# EAGLE schematic spin (EAGLE 6.3)
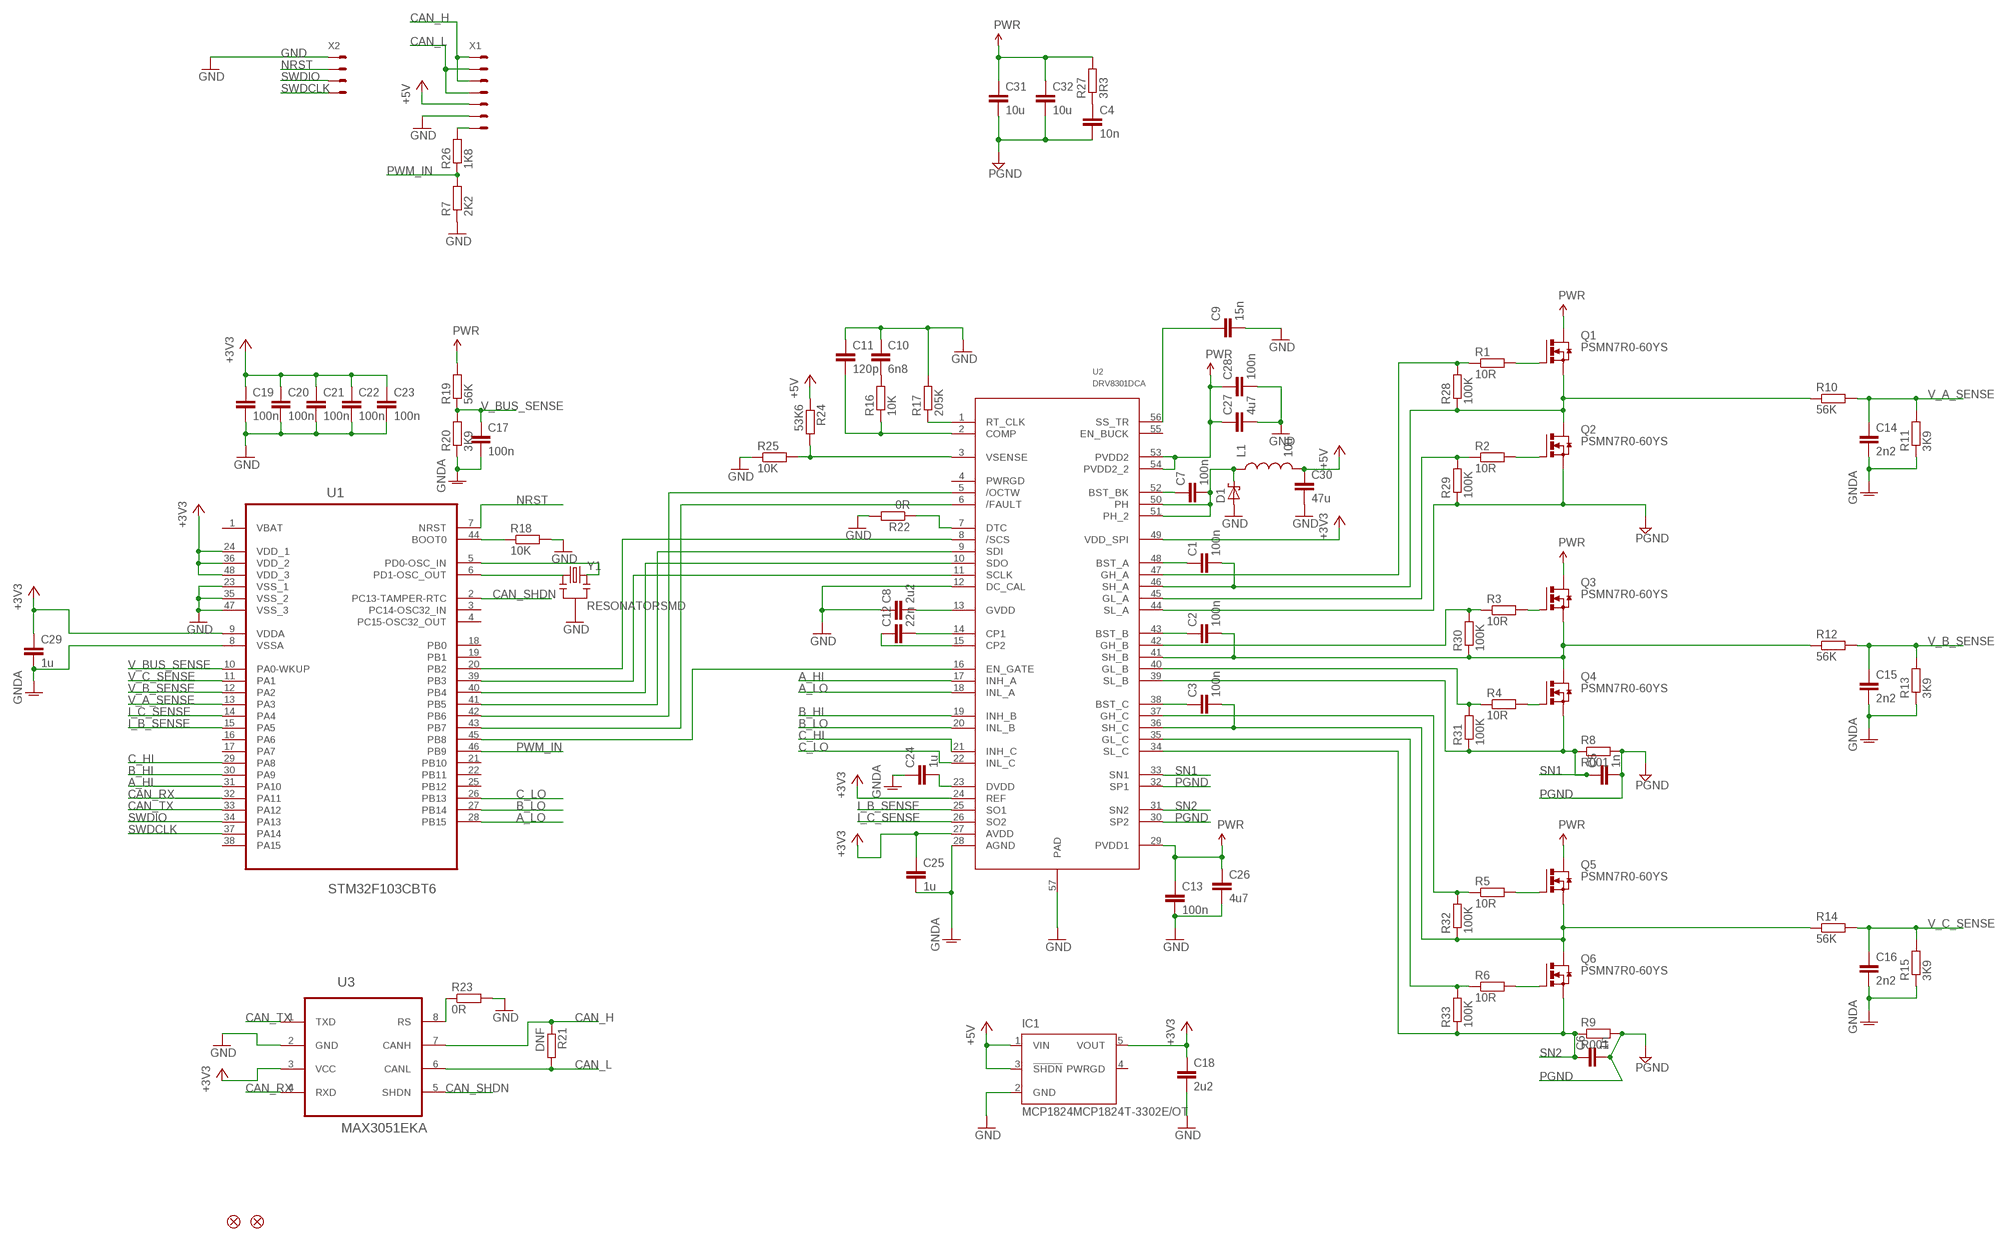
[diagram p0: schematic, sheet 1]

## Parts
C1  100n  C-EUC0603  [C0603]
C2  100n  C-EUC0603  [C0603]
C3  100n  C-EUC0603  [C0603]
C4  10n  C-EUC0603  [C0603]
C5  1n  C-EUC0603  [C0603]
C6  1n  C-EUC0603  [C0603]
C7  100n  C-EUC0603  [C0603]
C8  2u2  C-EUC0603  [C0603]
C9  15n  C-EUC0603  [C0603]
C10  6n8  C-EUC0603  [C0603]
C11  120p  C-EUC0603  [C0603]
C12  22n  C-EUC0603  [C0603]
C13  100n  C-EUC0603  [C0603]
C14  2n2  C-EUC0603  [C0603]
C15  2n2  C-EUC0603  [C0603]
C16  2n2  C-EUC0603  [C0603]
C17  100n  C-EUC0603  [C0603]
C18  2u2  C-EUC0603  [C0603]
C19  100n  C-EUC0603  [C0603]
C20  100n  C-EUC0603  [C0603]
C21  100n  C-EUC0603  [C0603]
C22  100n  C-EUC0603  [C0603]
C23  100n  C-EUC0603  [C0603]
C24  1u  C-EUC0603  [C0603]
C25  1u  C-EUC0603  [C0603]
C26  4u7  C-EUC0805  [C0805]
C27  4u7  C-EUC0805  [C0805]
C28  100n  C-EUC0603  [C0603]
C29  1u  C-EUC0603  [C0603]
C30  47u  CAP1210  [1210]
C31  10u  CAP1210  [1210]
C32  10u  CAP1210  [1210]
D1  STPS1H100AF  [SMA]
IC1  MCP1824MCP1824T-3302E/OT  [SOT23-5L]
JP1  FIDUCIALUFIDUCIAL  [MICRO-FIDUCIAL]
JP2  FIDUCIALUFIDUCIAL  [MICRO-FIDUCIAL]
L1  10u  INDUCTORNR6028  [NR6028]
Q1  PSMN7R0-60YS  [POWER-SO8-UNIVERSAL]
Q2  PSMN7R0-60YS  [POWER-SO8-UNIVERSAL]
Q3  PSMN7R0-60YS  [POWER-SO8-UNIVERSAL]
Q4  PSMN7R0-60YS  [POWER-SO8-UNIVERSAL]
Q5  PSMN7R0-60YS  [POWER-SO8-UNIVERSAL]
Q6  PSMN7R0-60YS  [POWER-SO8-UNIVERSAL]
R1  10R  R-EU_R0603  [R0603]
R2  10R  R-EU_R0603  [R0603]
R3  10R  R-EU_R0603  [R0603]
R4  10R  R-EU_R0603  [R0603]
R5  10R  R-EU_R0603  [R0603]
R6  10R  R-EU_R0603  [R0603]
R7  2K2  R-EU_R0603  [R0603]
R8  R001  R-EU_R1210  [R1210]
R9  R001  R-EU_R1210  [R1210]
R10  56K  R-EU_R0603  [R0603]
R11  3K9  R-EU_R0603  [R0603]
R12  56K  R-EU_R0603  [R0603]
R13  3K9  R-EU_R0603  [R0603]
R14  56K  R-EU_R0603  [R0603]
R15  3K9  R-EU_R0603  [R0603]
R16  10K  R-EU_R0603  [R0603]
R17  205K  R-EU_R0603  [R0603]
R18  10K  R-EU_R0603  [R0603]
R19  56K  R-EU_R0603  [R0603]
R20  3K9  R-EU_R0603  [R0603]
R21  DNF  R-EU_R0603  [R0603]
R22  0R  R-EU_R0603  [R0603]
R23  0R  R-EU_R0603  [R0603]
R24  53K6  R-EU_R0603  [R0603]
R25  10K  R-EU_R0603  [R0603]
R26  1K8  R-EU_R0603  [R0603]
R27  3R3  R-EU_R0805  [R0805]
R28  100K  R-EU_R0603  [R0603]
R29  100K  R-EU_R0603  [R0603]
R30  100K  R-EU_R0603  [R0603]
R31  100K  R-EU_R0603  [R0603]
R32  100K  R-EU_R0603  [R0603]
R33  100K  R-EU_R0603  [R0603]
U1  STM32F103CBT6  [QFP50P900X900X160-48N]
U2  DRV8301DCA  [TSSOP56P]
U3  MAX3051EKA  [SOT65P280X145-8N]
X1  SM07B-SRSS-TB  [SM07B-SRSS-TB]
X2  SM04B-SRSS-TB  [SM04B-SRSS-TB]
Y1  RESONATORSMD  [RESONATOR-SMD]

## Nets
+3V3: C18.1 C19.1 C20.1 C21.1 C22.1 C23.1 C25.1 C29.1 IC1.5(VOUT) U1.9(VDDA) U1.24(VDD_1) U1.36(VDD_2) U1.48(VDD_3) U2.24(REF) U2.27(AVDD) U2.49(VDD_SPI) U3.3(VCC)
+5V: C30.1 IC1.1(VIN) IC1.3(!SHDN) L1.2 R24.1 X1.5
A_HI: U1.31(PA10) U2.17(INH_A)
A_LO: U1.28(PB15) U2.18(INL_A)
B_HI: U1.30(PA9) U2.19(INH_B)
B_LO: U1.27(PB14) U2.20(INL_B)
C_HI: U1.29(PA8) U2.21(INH_C)
C_LO: U1.26(PB13) U2.22(INL_C)
CAN_H: R21.1 U3.7(CANH) X1.1 X1.3
CAN_L: R21.2 U3.6(CANL) X1.2 X1.4
CAN_RX: U1.32(PA11) U3.4(RXD)
CAN_SHDN: U1.2(PC13-TAMPER-RTC) U3.5(SHDN)
CAN_TX: U1.33(PA12) U3.1(TXD)
GND: C8.1 C9.2 C10.1 C11.1 C13.2 C18.2 C19.2 C20.2 C21.2 C22.2 C23.2 C26.2 C27.2 C28.2 C30.2 D1.A IC1.2(GND) R7.1 R17.2 R18.2 R22.2 R23.2 R25.1 U1.23(VSS_1) U1.35(VSS_2) U1.47(VSS_3) U2.12(DC_CAL) U2.57(PAD) U3.2(GND) X1.6 X2.1 Y1.2
GNDA: C14.2 C15.2 C16.2 C17.2 C24.1 C25.2 C29.2 R11.1 R13.1 R15.1 R20.1 U1.8(VSSA) U2.28(AGND)
I_B_SENSE: U1.15(PA5) U2.25(SO1)
I_C_SENSE: U1.14(PA4) U2.26(SO2)
N$1: Q1.4(G) R1.2
N$2: Q2.4(G) R2.2
N$3: Q3.4(G) R3.2
N$5: Q6.4(G) R6.2
N$6: Q5.4(G) R5.2
N$7: C3.2 Q5.1(S) Q5.2(S) Q5.3(S) Q6.5(D) Q6.6(D) R14.1 R32.1 U2.36(SH_C)
N$8: C2.2 Q3.1(S) Q3.2(S) Q3.3(S) Q4.5(D) Q4.6(D) R12.1 R30.1 U2.41(SH_B)
N$9: C1.2 Q1.1(S) Q1.2(S) Q1.3(S) Q2.5(D) Q2.6(D) R10.1 R28.1 U2.46(SH_A)
N$10: R4.1 R31.2 U2.40(GL_B)
N$11: R3.1 R30.2 U2.42(GH_B)
N$12: R5.1 R32.2 U2.37(GH_C)
N$13: R6.1 R33.2 U2.35(GL_C)
N$16: R1.1 R28.2 U2.47(GH_A)
N$17: C7.1 U2.52(BST_BK)
N$18: R2.1 R29.2 U2.45(GL_A)
N$19: R26.2 X1.7
N$20: C7.2 D1.C L1.1 U2.50(PH) U2.51(PH_2)
N$21: C1.1 U2.48(BST_A)
N$22: C2.1 U2.43(BST_B)
N$23: C3.1 U2.38(BST_C)
N$25: C11.2 R16.1 U2.2(COMP)
N$26: R17.1 U2.1(RT_CLK)
N$28: R18.1 U1.44(BOOT0)
N$29: C8.2 U2.13(GVDD)
N$31: R23.1 U3.8(RS)
N$32: C12.2 U2.14(CP1)
N$33: C12.1 U2.15(CP2)
N$34: C10.2 R16.2
N$35: C24.2 U2.23(DVDD)
N$36: U1.39(PB3) U2.11(SCLK)
N$37: C9.1 U2.56(SS_TR)
N$38: R22.1 U2.7(DTC)
N$39: R24.2 R25.2 U2.3(VSENSE)
N$40: U1.40(PB4) U2.10(SDO)
N$41: U1.41(PB5) U2.9(SDI)
N$42: U1.42(PB6) U2.5(/OCTW)
N$43: U1.43(PB7) U2.6(/FAULT)
N$44: U1.45(PB8) U2.16(EN_GATE)
N$130: U1.6(PD1-OSC_OUT) Y1.1
N$131: U1.5(PD0-OSC_IN) Y1.3
N$132: C4.1 R27.1
NRST: U1.7(NRST) X2.2
PGND: C4.2 C5.2 C6.2 C31.2 C32.2 Q2.1(S) Q2.2(S) Q2.3(S) R8.2 R9.2 R29.1 U2.30(SP2) U2.32(SP1) U2.44(SL_A)
PWM_IN: R7.2 R26.1 U1.46(PB9)
PWR [HVPWR]: C13.1 C26.1 C27.1 C28.1 C31.1 C32.1 Q1.5(D) Q1.6(D) Q3.5(D) Q3.6(D) Q5.5(D) Q5.6(D) R19.2 R27.2 U2.29(PVDD1) U2.53(PVDD2) U2.54(PVDD2_2)
Q4: Q4.4(G) R4.2
SN1: C5.1 Q4.1(S) Q4.2(S) Q4.3(S) R8.1 R31.1 U2.33(SN1) U2.39(SL_B)
SN2: C6.1 Q6.1(S) Q6.2(S) Q6.3(S) R9.1 R33.1 U2.31(SN2) U2.34(SL_C)
SPI_!CS: U1.20(PB2) U2.8(/SCS)
SWDCLK: U1.37(PA14) X2.4
SWDIO: U1.34(PA13) X2.3
V_A_SENSE: C14.1 R10.2 R11.2 U1.13(PA3)
V_B_SENSE: C15.1 R12.2 R13.2 U1.12(PA2)
V_BUS_SENSE: C17.1 R19.1 R20.2 U1.10(PA0-WKUP)
V_C_SENSE: C16.1 R14.2 R15.2 U1.11(PA1)
Unconnected: IC1.4(PWRGD) U1.1(VBAT) U1.3(PC14-OSC32_IN) U1.4(PC15-OSC32_OUT) U1.16(PA6) U1.17(PA7) U1.18(PB0) U1.19(PB1) U1.21(PB10) U1.22(PB11) U1.25(PB12) U1.38(PA15) U2.4(PWRGD) U2.55(EN_BUCK)

## Library data of the parts
C1-C29 = FOC ESC:C-EU: CAPACITOR, European symbol
C30-C32 = SparkFun:CAP: Capacitor Standard 0603 ceramic capacitor, and 0.1" leaded capacitor.
D1 = FOC ESC:STPS1H100AF: DIODE SCHOTTKY 100V 1A SMA FLAT
IC1 = FOC ESC:MCP1824: Low Dropout Regulator (LDO) with shutdown and power good functions
JP1 JP2 = FOC ESC:FIDUCIAL: Fiducial Alignment Points Various fiducial points for machine vision alignment.
L1 = FOC ESC:INDUCTOR: Inductors Basic Inductor/Choke - 0603 and 1206. Footprints are not proven and vary greatly between part numbers.
Q1-Q6 = FOC ESC:PSMN7R0-60YS: N-channel LFPAK 60 V 6.4 mΩ standard level MOSFET
R1-R33 = FOC ESC:R-EU_: RESISTOR, European symbol
U1 = FOC ESC:STM32F103CBT6: Medium-density performance line ARM-based 32-bit MCU; MPN: STM32F103CBT6; OC_FARNELL: 1606327; OC_NEWARK: 11N8296; PACKAGE: QFP-48; SUPPLIER: STMICROELECTRONICS
U2 = FOC ESC:DRV8301DCA: 3-Phase Brushless Motor Pre-Driver with Dual Current Sense Amps and Buck Converter
U3 = FOC ESC:MAX3051EKA: +3.3V, 1Mbps, Low-Supply-Current CAN Transceiver; MPN: MAX3051EKA; OC_FARNELL: -; OC_NEWARK: 07R7042; PACKAGE: SOT-23-8; SUPPLIER: Maxim
X1 = FOC ESC:?M07B-SRSS-TB: Disconnectable Crimp style connector, 1.0mm pitch 7 contacts
X2 = FOC ESC:?M04B-SRSS-TB: Disconnectable Crimp style connector, 1.0mm pitch 4 contacts
Y1 = FOC ESC:RESONATOR: Resonator Small SMD resonator. This is the itty bitty 10/20MHz resonators with built in caps. CSTCE10M0G55 and CSTCE20M0V53. Footprint has been reviewed closely but hasn't been tested yet.

## Net classes
1 HVPWR: clearance 0.4 mm